# EAGLE schematic diseño_placa_pcb (EAGLE 9.6.2)
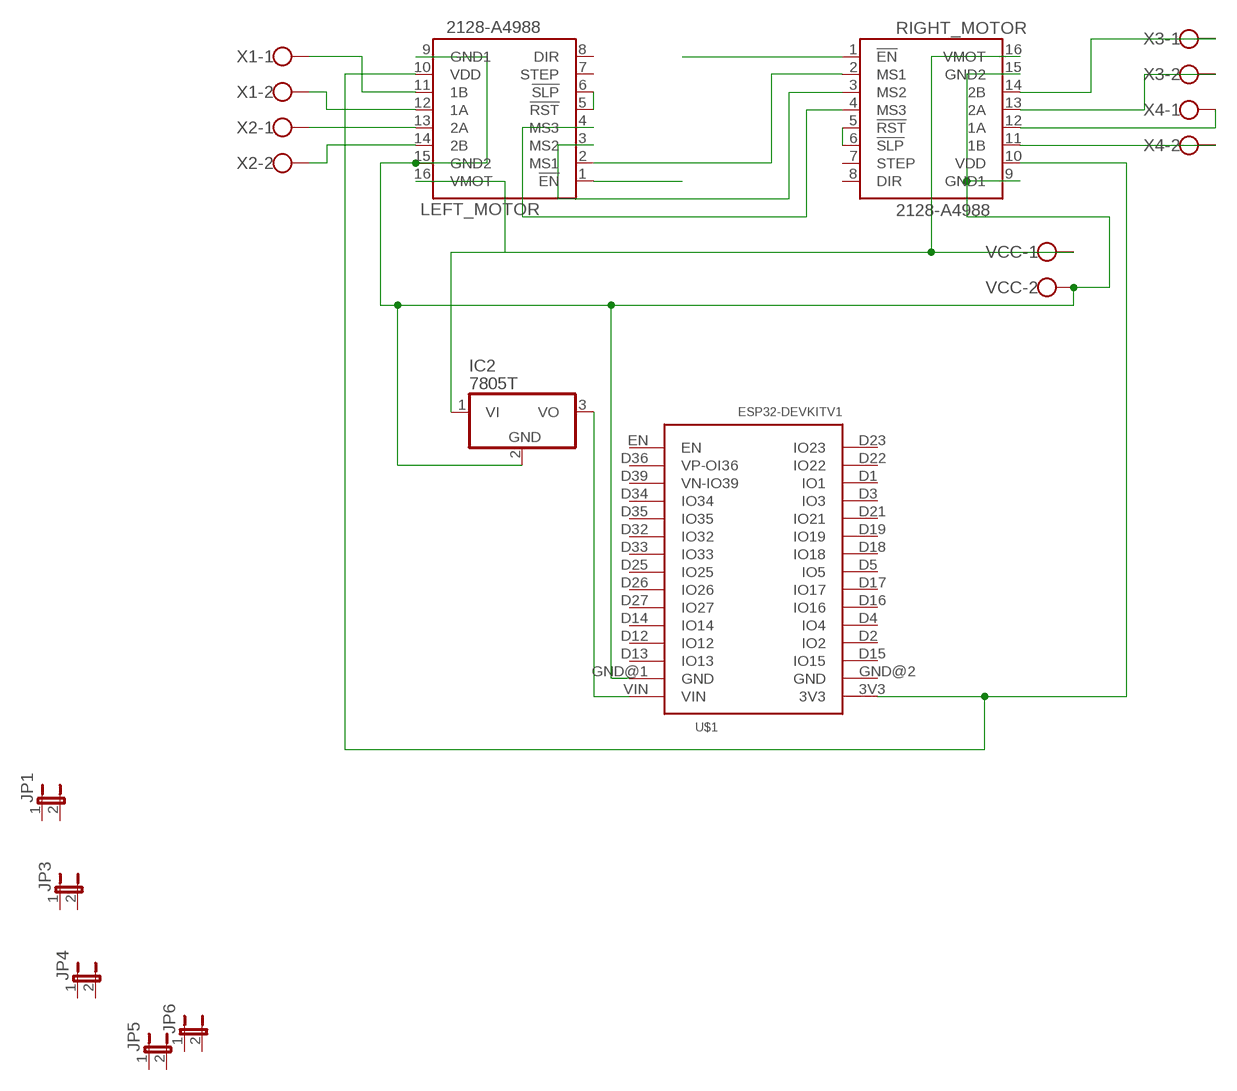
[diagram p0: schematic, sheet 1]

## Parts
IC2  7805T  [TO220H]
JP1  JP1E  [JP1]
JP3  JP1E  [JP1]
JP4  JP1E  [JP1]
JP5  JP1E  [JP1]
JP6  JP1E  [JP1]
LEFT_MOTOR  2128-A4988  [A4988]
RIGHT_MOTOR  2128-A4988  [A4988]
U$1  ESP32DEVKITV1  [ESP32-DEVKITV1]
VCC  W237-102  [W237-102]
X1  W237-102  [W237-102]
X2  W237-102  [W237-102]
X3  W237-102  [W237-102]
X4  W237-102  [W237-102]

## Nets
N$1: LEFT_MOTOR.4(MS3) RIGHT_MOTOR.4(MS3)
N$2: RIGHT_MOTOR.14(2B) X3.1
N$3: RIGHT_MOTOR.13(2A) X3.2
N$4: RIGHT_MOTOR.12(1A) X4.1
N$5: RIGHT_MOTOR.11(1B) X4.2
N$6: IC2.2(GND) LEFT_MOTOR.9(GND1) LEFT_MOTOR.15(GND2) RIGHT_MOTOR.9(GND1) RIGHT_MOTOR.15(GND2) U$1.GND@1(GND) VCC.2
N$7: LEFT_MOTOR.2(MS1) RIGHT_MOTOR.2(MS1)
N$8: LEFT_MOTOR.5(!RST) LEFT_MOTOR.6(!SLP)
N$9: LEFT_MOTOR.3(MS2) RIGHT_MOTOR.3(MS2)
N$10: IC2.1(VI) LEFT_MOTOR.16(VMOT) RIGHT_MOTOR.16(VMOT) VCC.1
N$11: RIGHT_MOTOR.5(!RST) RIGHT_MOTOR.6(!SLP)
N$12: RIGHT_MOTOR.1(!EN)
N$13: IC2.3(VO) U$1.VIN
N$14: LEFT_MOTOR.1(!EN)
N$15: LEFT_MOTOR.10(VDD) RIGHT_MOTOR.10(VDD) U$1.3V3
N$16: LEFT_MOTOR.11(1B) X1.1
N$17: LEFT_MOTOR.12(1A) X1.2
N$18: LEFT_MOTOR.13(2A) X2.1
N$19: LEFT_MOTOR.14(2B) X2.2
Unconnected: JP1.1 JP1.2 JP3.1 JP3.2 JP4.1 JP4.2 JP5.1 JP5.2 JP6.1 JP6.2 LEFT_MOTOR.7(STEP) LEFT_MOTOR.8(DIR) RIGHT_MOTOR.7(STEP) RIGHT_MOTOR.8(DIR) U$1.D1(IO1) U$1.D2(IO2) U$1.D3(IO3) U$1.D4(IO4) U$1.D5(IO5) U$1.D12(IO12) U$1.D13(IO13) U$1.D14(IO14) U$1.D15(IO15) U$1.D16(IO16) U$1.D17(IO17) U$1.D18(IO18) U$1.D19(IO19) U$1.D21(IO21) U$1.D22(IO22) U$1.D23(IO23) U$1.D25(IO25) U$1.D26(IO26) U$1.D27(IO27) U$1.D32(IO32) U$1.D33(IO33) U$1.D34(IO34) U$1.D35(IO35) U$1.D36(VP-OI36) U$1.D39(VN-IO39) U$1.EN U$1.GND@2(GND)

## Library data of the parts
IC2 = linear:78*: Positive VOLTAGE REGULATOR Source: http://cache.national.com/ds/LM/LM78L05.pdf http://www.fairchildsemi.com/ds/LM/LM7805.pdf
JP1 JP3-JP6 = jumper:JP1E: JUMPER
LEFT_MOTOR RIGHT_MOTOR = pololu-stepper-driver:2128-A4988: A4988 Stepper Motor Driver Carrier; Black Edition #2128 A4988 Stepper Motor Driver Carrier; Black Edition <https://www.pololu.com/product/2128> in Japan, Suzaku Lab. Ltd. <https://suzakugiken.jp/> #2128 A4988ステッピングモータドライバ Black Edition <https://szc.jp/po2128>
U$1 = ESP32-DEVKITV1:ESP32DEVKITV1
VCC X1-X4 = con-wago-500:W237-102: WAGO SCREW CLAMP; MPN: 237-102; OC_FARNELL: unknown; OC_NEWARK: 70K9898

## Net classes
0 default: clearance 0.205 mm